# Altium project CropSenseMovement.PrjPcb
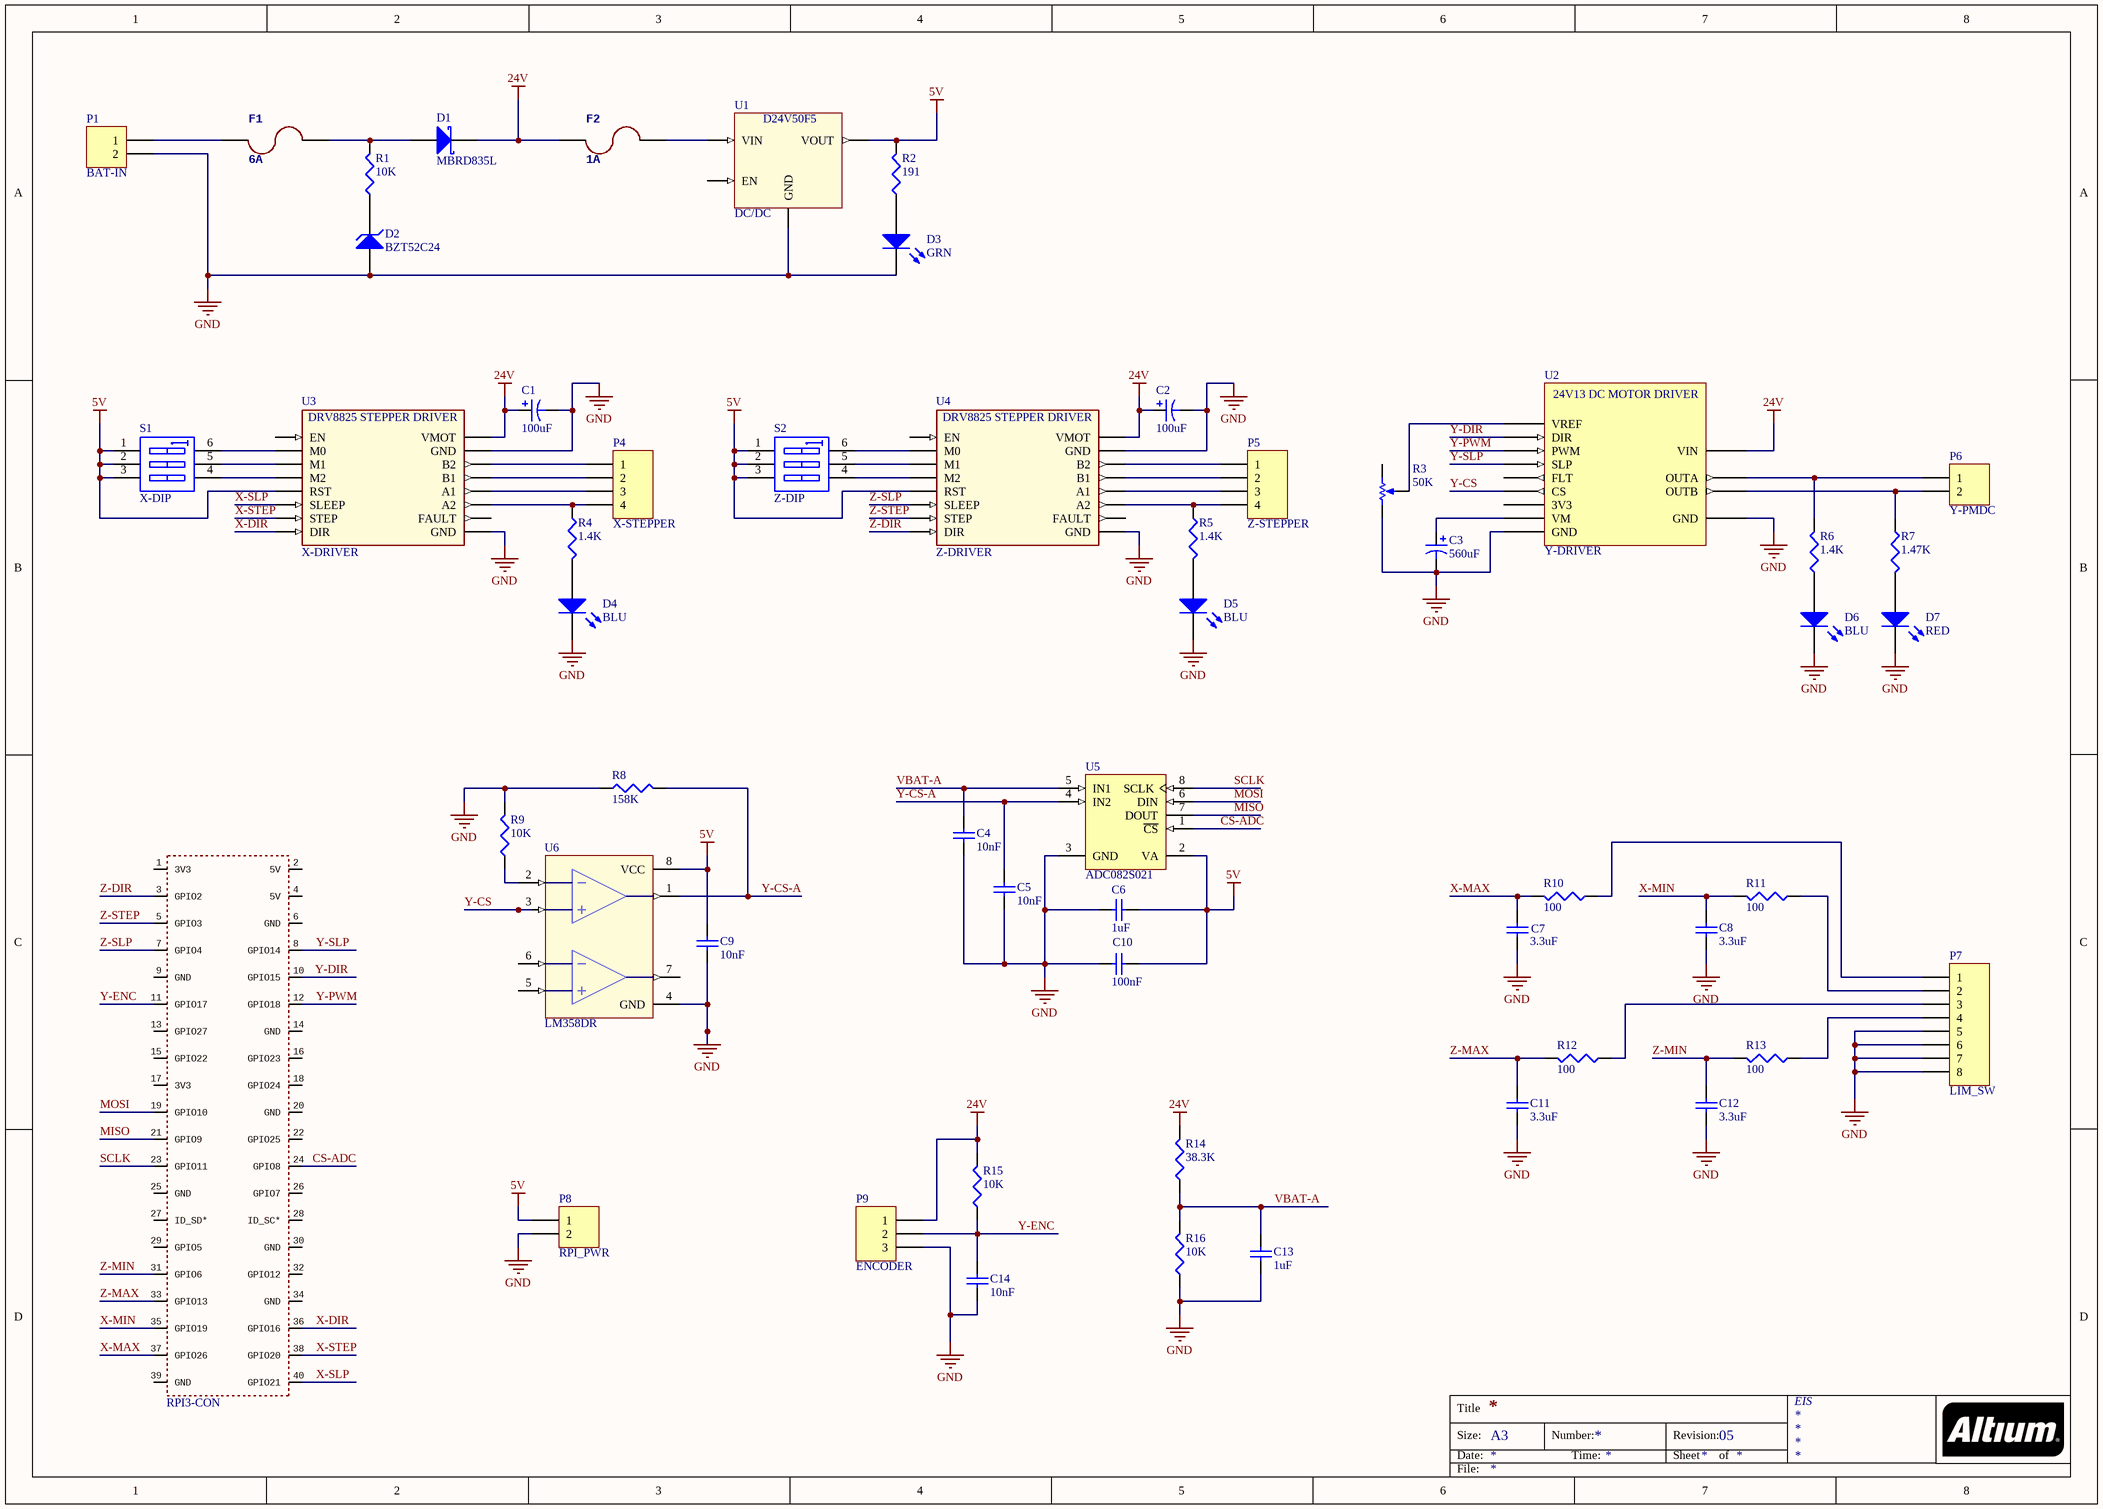
[diagram p0: CropSenseMovement.SchDoc]
1 sheet, 55 parts. Net scope: global (net labels, ports and power ports of the same name join across sheets).
Board file: CropSenseMovement.PcbDoc

## Sheet CropSenseMovement.SchDoc
size A3; Organization: EIS; Revision: 05; PageSetup: Record=PageOptions|CenterHorizontal=True|CenterVertical=True|PrintScale=1.04|XCorrection=1.00|YCorrection=1.00|PrintKind=1|BorderSize=5000000|LeftOffset=0|BottomOffset=0|Orientation=2|PaperLength=1000|PaperWidth=1000|Scale=100|PaperSource=7|PrintQuality=600|MediaType=1|DitherType=10|PrintScaleMode=1|PaperKind=A3|PaperIndex=8; ProjectName: VanBelle CropSense Movement

### Parts
C1  100uF  [CAP 8mm]
C2  100uF  [CAP 8mm]
C3  560uF  [CAP 12.5MM]
C4  10nF  [C1206]
C5  10nF  [C1206]
C6  1uF  [C1206]
C7  3.3uF  [C1206]
C8  3.3uF  [C1206]
C9  10nF  [C1206]
C10  100nF  [C1206]
C11  3.3uF  [C1206]
C12  3.3uF  [C1206]
C13  1uF  [C1206]
C14  10nF  [C1206]
D1  MBRD835L  [DPAK229P991X238-3N]
D2  BZT52C24  [SOD123]
D3  GRN  [1206 SMD LED]
D4  BLU  [1206 SMD LED]
D5  BLU  [1206 SMD LED]
D6  BLU  [1206 SMD LED]
D7  RED  [1206 SMD LED]
F1  6A  [5X20MM_LITTLEFUSE_CARTRIDGE]
F2  1A  [5X20MM_LITTLEFUSE_CARTRIDGE]
P1  BAT-IN  [MOLEX_MINI_1X2CCT]
P4  X-STEPPER  [MOLEX_Micro_4x1CCT]
P5  Z-STEPPER  [MOLEX_Micro_4x1CCT]
P6  Y-PMDC  [MOLEX_MINI_1X2CCT]
P7  LIM_SW  [MOLEX_MICRO_4X2CCT]
P8  RPI_PWR  [MOLEX_MICRO_2X1CCT]
P9  ENCODER  [MOLEX_MICRO_3X1CCT]
R1  10K  [6-0805_N]
R2  191  [6-0805_N]
R3  50K  [Trimpot TC33]
R4  1.4K  [6-0805_N]
R5  1.4K  [6-0805_N]
R6  1.4K  [6-0805_N]
R7  1.47K  [6-0805_N]
R8  158K  [6-0805_N]
R9  10K  [6-0805_N]
R10  100  [6-0805_N]
R11  100  [6-0805_N]
R12  100  [6-0805_N]
R13  100  [6-0805_N]
R14  38.3K  [6-0805_N]
R15  10K  [6-0805_N]
R16  10K  [6-0805_N]
S1  X-DIP  [DIP-6]
S2  Z-DIP  [DIP-6]
U1  DC/DC  [D24VXXFX_BREAKOUT]
U2  Y-DRIVER  [24V13_BREAKOUT]
U3  X-DRIVER  [DRV8825_BREAKOUT]
U4  Z-DRIVER  [DRV8825_BREAKOUT]
U5  ADC082S021  [TI-DGK8_N]
U6  LM358DR  [SOIC127P600X175-8N]
U$2  RPI3-CON  [CONNECTOR]

### Nets
5V: C6.2 C9.1 C10.2 P8.1 R2.2 S1.1(A1) S1.2(A2) S1.3(A3) S2.1(A1) S2.2(A2) S2.3(A3) U1.VOUT U3.RST U4.RST U5.2(VA) U6.8(VCC)
24V: C1.1 C2.1 D1.2(K) F2.1 P9.1 R14.2 R15.2 U2.VIN U3.VMOT U4.VMOT
GND: C1.2 C2.2 C3.2 C4.2 C5.2 C6.1 C7.1 C8.1 C9.2 C10.1 C11.1 C12.1 C13.1 C14.1 D2.1(A) D3.2(K) D4.2(K) D5.2(K) D6.2(K) D7.2(K) P1.2 P7.5 P7.6 P7.7 P7.8 P8.2 P9.3 R3.3(TOP) R8.1 R9.2 R16.1 U1.GND U2.GND U3.GND U4.GND U5.3(GND) U6.4(GND)
CS-ADC: U5.1(~{CS}) U$2.24(GPIO8)
MISO: U5.7(DOUT) U$2.21(GPIO9)
MOSI: U5.6(DIN) U$2.19(GPIO10)
SCLK: U5.8(SCLK) U$2.23(GPIO11)
VBAT-A: C4.1 C13.2 R14.1 R16.2 U5.5(IN1)
X-DIR: U3.DIR U$2.36(GPIO16)
X-MAX: C7.2 R10.2 U$2.37(GPIO26)
X-MIN: C8.2 R11.2 U$2.35(GPIO19)
X-SLP: U3.SLP(SLEEP) U$2.40(GPIO21)
X-STEP: U3.STEP U$2.38(GPIO20)
Y-CS: U2.CS U6.3(IN1+)
Y-CS-A: C5.1 R8.2 U5.4(IN2) U6.1(OUT1)
Y-DIR: U2.DIR U$2.10(GPIO15)
Y-ENC: C14.2 P9.2 R15.1 U$2.11(GPIO17)
Y-PWM: U2.PWM U$2.12(GPIO18)
Y-SLP: U2.SLP U$2.8(GPIO14)
Z-DIR: U4.DIR U$2.3(GPIO2)
Z-MAX: C11.2 R12.2 U$2.33(GPIO13)
Z-MIN: C12.2 R13.2 U$2.31(GPIO6)
Z-SLP: U4.SLP(SLEEP) U$2.7(GPIO4)
Z-STEP: U4.STEP U$2.5(GPIO3)
NetC3_1: C3.1 U2.VM
NetD1_1: D1.1(A) F1.2 R1.2
NetD2_2: D2.2(K) R1.1
NetD3_1: D3.1(A) R2.1
NetD4_1: D4.1(A) R4.2
NetD5_1: D5.1(A) R5.2
NetD6_1: D6.1(A) R6.1
NetD7_1: D7.1(A) R7.2
NetF1_1: F1.1 P1.1
NetF2_2: F2.2 U1.VIN
NetP4_1: P4.1 U3.B2
NetP4_2: P4.2 U3.B1
NetP4_3: P4.3 U3.A1
NetP4_4: P4.4 R4.1 U3.A2
NetP5_1: P5.1 U4.B2
NetP5_2: P5.2 U4.B1
NetP5_3: P5.3 U4.A1
NetP5_4: P5.4 R5.1 U4.A2
NetP6_1: P6.1 R6.2 U2.OUTA
NetP6_2: P6.2 R7.1 U2.OUTB
NetP7_1: P7.1 R10.1
NetP7_2: P7.2 R11.1
NetP7_3: P7.3 R12.1
NetP7_4: P7.4 R13.1
NetR3_2: R3.2(TAP) U2.VREF
NetR9_1: R9.1 U6.2(IN1-)
NetS1_4: S1.4(B3) U3.M2
NetS1_5: S1.5(B2) U3.M1
NetS1_6: S1.6(B1) U3.M0
NetS2_4: S2.4(B3) U4.M2
NetS2_5: S2.5(B2) U4.M1
NetS2_6: S2.6(B1) U4.M0

Not connected (* = marked no-connect by the designer): R3 1(BOT); U1 EN; U2 3V3 FLT; U3 EN FAULT; U4 EN FAULT; U6 5(IN2+) 6(IN2-) 7(OUT2); U$2 1(3V3) 2(5V) 4(5V) 6(GND) 9(GND) 13(GPIO27) 14(GND) 15(GPIO22) 16(GPIO23) 17(3V3) 18(GPIO24) 20(GND) 22(GPIO25) 25(GND) 26(GPIO7) 27(ID_SD*) 28(ID_SC*) 29(GPIO5) 30(GND) 32(GPIO12) 34(GND) 39(GND)

### Notes on the sheet
- Title
- Size:
- Date:
- A3
- Number:
- Time:
- Revision:
- Sheet
- of
- File:
- (in symbol 24V13_BREAKOUT) 24V13 DC MOTOR DRIVER
- (in symbol DRV8825_BREAKOUT) DRV8825 STEPPER DRIVER

### Library data of the parts
C1-C3 = Cap Pol: Polarized Capacitor (Axial); Published: 8-Jun-2000; LatestRevisionDate: 17-Jul-2002; LatestRevisionNote: Re-released for DXP Platform.; PackageReference: POLAR0.8; Publisher: Altium Limited; PackageDescription: Polarized Capacitor; 2 Leads
  C1 C2: Value: 100uF
  C3: Value: 560uF
C4-C14 = Cap Semi: Capacitor (Semiconductor SIM Model); Published: 8-Jun-2000; LatestRevisionDate: 29-May-2009; LatestRevisionNote: IPC-7351 Footprint Added.; PackageReference: C1206; Publisher: Altium Limited; PackageDescription: Chip Capacitor
  C4 C5 C9 C14: Value: 10nF
  C6 C13: Value: 1uF
  C7 C8 C11 C12: Value: 3.3uF
  C10: Value: 100nF
D1 = D Schottky: Schottky Diode; Published: 8-Jun-2000; LatestRevisionDate: 17-Jul-2002; LatestRevisionNote: Re-released for DXP Platform.; PackageReference: SMB; Publisher: Altium Limited; PackageDescription: DO-214-AA/SMB; 2 C-Bend Leads; Body 5.3 x 3.6 mm, inc. leads (LxW); Code_JEDEC: DO-214-AA
D2 = D Zener: Zener Diode; Published: 8-Jun-2000; LatestRevisionDate: 17-Jul-2002; LatestRevisionNote: Re-released for DXP Platform.; PackageReference: DIODE-0.7; Publisher: Altium Limited; PackageDescription: Diode, Thru-Hole; 2 Leads; 0.7 in Pin Spacing
D3-D7 = LED: Typical INFRARED GaAs LED; Published: 8-Jun-2000; LatestRevisionDate: 08-Jul-2005; LatestRevisionNote: Mech Layer 1 removed.; PackageReference: LED-0; Publisher: Altium Limited; PackageDescription: LED; 2 Leads
F1 F2 = FUSE_5X20_LITTLEFUSE: 5mm x 20mm Littlefuse Cartridge
  F1: Value: 6A
  F2: Value: 1A
P1 P6 = MOLEX_MINI_1X2: Molex Mini Fit 2 cct Double Row
P4 P5 = MOLEX_MICRO_4x1
P7 = MOLEX_MICRO_4X2: Molex Micro Fit 8 cct Double Row
P8 = MOLEX_MICRO_2x1: Molex Micro Fit 2 cct Single Row
P9 = MOLEX_MICRO_3x1: Molex Micro Fit 3 cct Single Row
R1 R2 R4-R16 = Res3: Resistor; Published: 8-Jun-2000; LatestRevisionDate: 29-May-2009; LatestRevisionNote: IPC-7351 Footprint Added.; PackageReference: J1-0603; Publisher: Altium Limited; PackageDescription: Chip Resistor
  R1 R9 R15 R16: Value: 10K
  R2: Value: 191
  R4-R6: Value: 1.4K
  R7: Value: 1.47K
  R8: Value: 158K
  R10-R13: Value: 100
  R14: Value: 38.3K
R3 = RPot: TRIMMER 50K OHM 0.1W SMD; Sim Note: Enter the Resistance value and the set point into parameter fields.; Set Position: 0.5; Published: 8-Jun-2000; LatestRevisionDate: 17-Jul-2002; LatestRevisionNote: Re-released for DXP Platform.; PackageReference: VR5; Publisher: Altium Limited; PackageDescription: Variable Resistor, Thru-Hole; 3 Leads; Value: 50K
S1 S2 = SW DIP-3: DIP Switch, 3 Position, SPST; Published: 24-Mar-1999; LatestRevisionDate: 17-Jul-2002; LatestRevisionNote: Re-released for DXP Platform.; PackageReference: DIP-6; Publisher: Altium Limited; Code_JEDEC: MO-001-AM
U1 = D24V50F5
U2 = 24V13_BREAKOUT
U3 U4 = DRV8825_BREAKOUT
U5 = CMP-0003-00004-1: 2 Channel, 50 to 200 kSPS 8-Bit ADC, -40 to 85 degC, 8-pin SOP (DGK8), Green (RoHS & no Sb/Br); PartNumber: ADC122S051QIMM/NOPB; Manufacturer: Texas Instruments; Architecture: SAR; Digital Supply(Min)(V): 2.7; SNR(dB): 72.5; Interface: Serial SPI, QSPI, Microwire (Serial I/O); ENOB(Bits): 11.7; SINAD(dB): 72; # Input Channels: 2; INL(Max)(+/-LSB): 1.1; Analog Voltage AV/DD(Max)(V): 5.25; Resolution(Bits): 12; SFDR(dB): 86; Sample Rate(max)(SPS): 500k; SubFamily: Precision ADC (<=10MSPS); ComponentLink1Description: Manufacturer URL; PackageDescription: 8-Pin Thin Small Outline, Body 3 x 3 mm, Pitch 0.65 mm; Analog Voltage AV/DD(Min)(V): 2.7; Eco-Plan: Green (RoHS & no Sb/Br); ComponentLink2URL: http://www.ti.com/lit/ds/symlink/adc122s051q-q1.pdf; ComponentLink3URL: http://www.ti.com/litv/pdf/mpds028d; ComponentLink1URL: http://www.ti.com/; PackageReference: DGK8; ComponentLink2Description: Datasheet; Mounting Technology: Surface Mount; DatasheetVersion: SNAS257E; PackageVersion: 4073329/E, 05/2006; ComponentLink3Description: Package Specification; Code_JEDEC: MO-187; Digital Supply(Max)(V): 5.25
U$2 = RPI3_CON